# EAGLE design ltc3886_breakout_circuit (EAGLE 9.3.0)
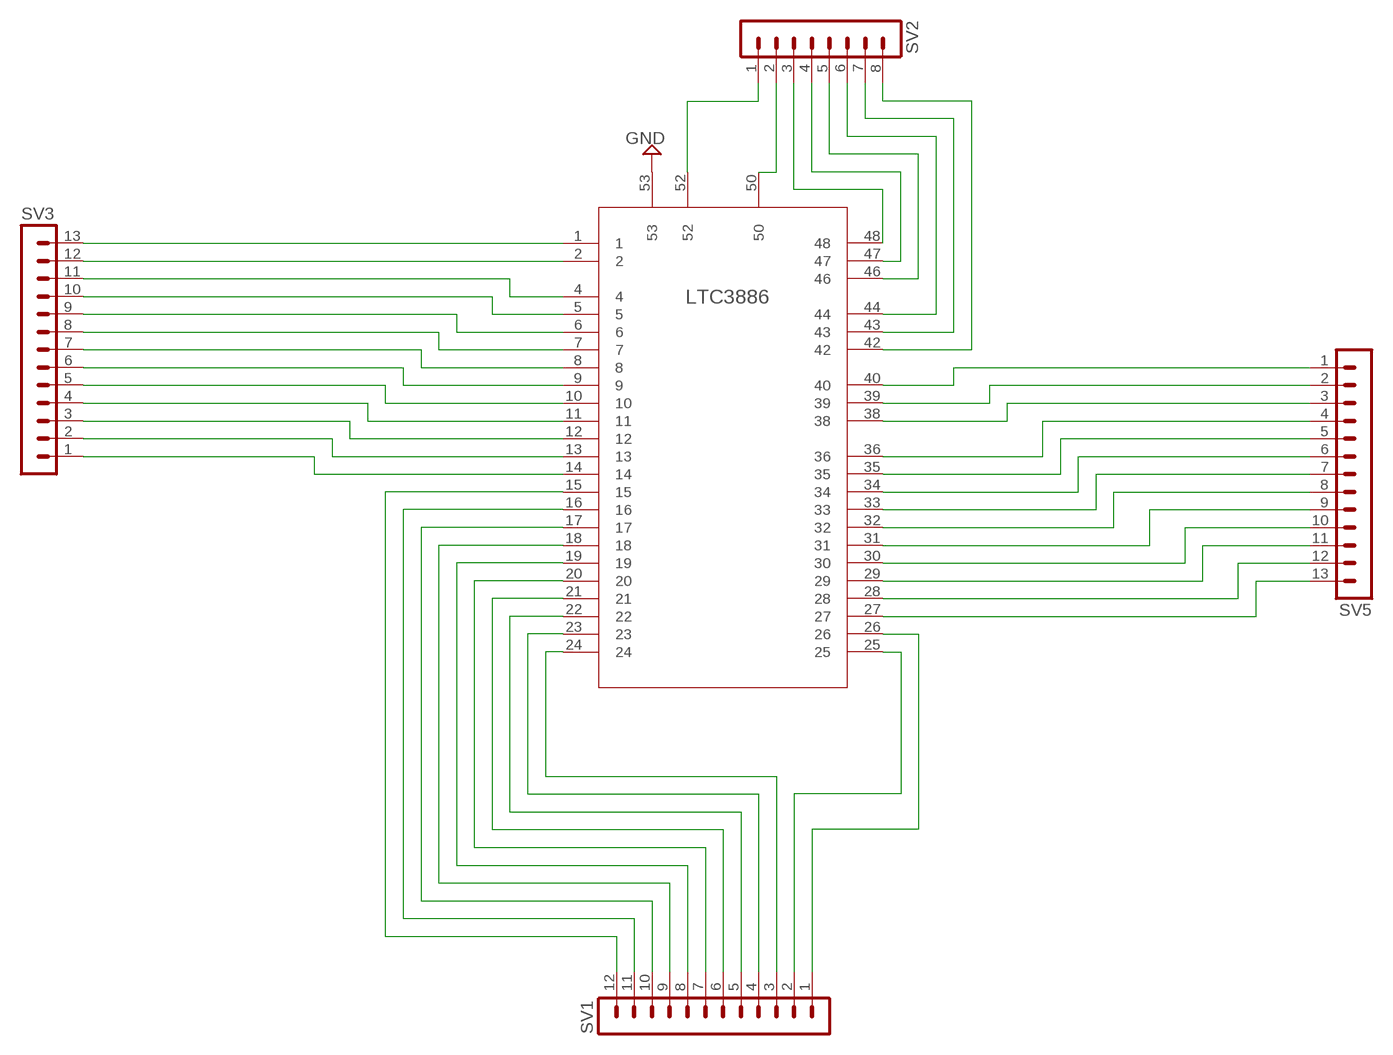
[diagram p0: schematic, sheet 1]

## Parts
SV1  MA12-1  [MA12-1]
SV2  MA08-1  [MA08-1]
SV3  MA13-1  [MA13-1]
SV5  MA13-1  [MA13-1]
U$1  LTC3886  [QFN-52_UKG_2]

## Nets
GND: U$1.53
N$1: SV3.13 U$1.1
N$2: SV3.12 U$1.2
N$3: SV3.11 U$1.4
N$4: SV3.10 U$1.5
N$5: SV3.9 U$1.6
N$6: SV3.8 U$1.7
N$7: SV3.7 U$1.8
N$8: SV3.6 U$1.9
N$9: SV3.5 U$1.10
N$10: SV3.4 U$1.11
N$11: SV3.3 U$1.12
N$12: SV3.2 U$1.13
N$13: SV3.1 U$1.14
N$14: SV1.12 U$1.15
N$15: SV1.11 U$1.16
N$16: SV1.10 U$1.17
N$17: SV1.9 U$1.18
N$18: SV1.8 U$1.19
N$19: SV1.7 U$1.20
N$20: SV1.6 U$1.21
N$21: SV2.3 U$1.48
N$22: SV2.4 U$1.47
N$23: SV2.5 U$1.46
N$24: SV2.6 U$1.44
N$25: SV2.7 U$1.43
N$26: SV2.8 U$1.42
N$27: SV5.1 U$1.40
N$28: SV5.2 U$1.39
N$29: SV5.3 U$1.38
N$30: SV5.4 U$1.36
N$31: SV5.5 U$1.35
N$32: SV5.6 U$1.34
N$33: SV5.7 U$1.33
N$34: SV5.8 U$1.32
N$35: SV5.9 U$1.31
N$36: SV5.10 U$1.30
N$37: SV5.11 U$1.29
N$38: SV5.12 U$1.28
N$39: SV5.13 U$1.27
N$40: SV1.1 U$1.26
N$41: SV1.5 U$1.22
N$42: SV1.4 U$1.23
N$43: SV1.3 U$1.24
N$44: SV1.2 U$1.25
N$45: SV2.1 U$1.52
N$46: SV2.2 U$1.50

## Library data of the parts
SV1 = con-lstb:MA12-1: PIN HEADER; OC_FARNELL: unknown; OC_NEWARK: unknown
SV2 = con-lstb:MA08-1: PIN HEADER; OC_FARNELL: unknown; OC_NEWARK: unknown
SV3 SV5 = con-lstb:MA13-1: PIN HEADER; OC_FARNELL: unknown; OC_NEWARK: unknown
U$1 = ltc3886:LTC3886

## Board
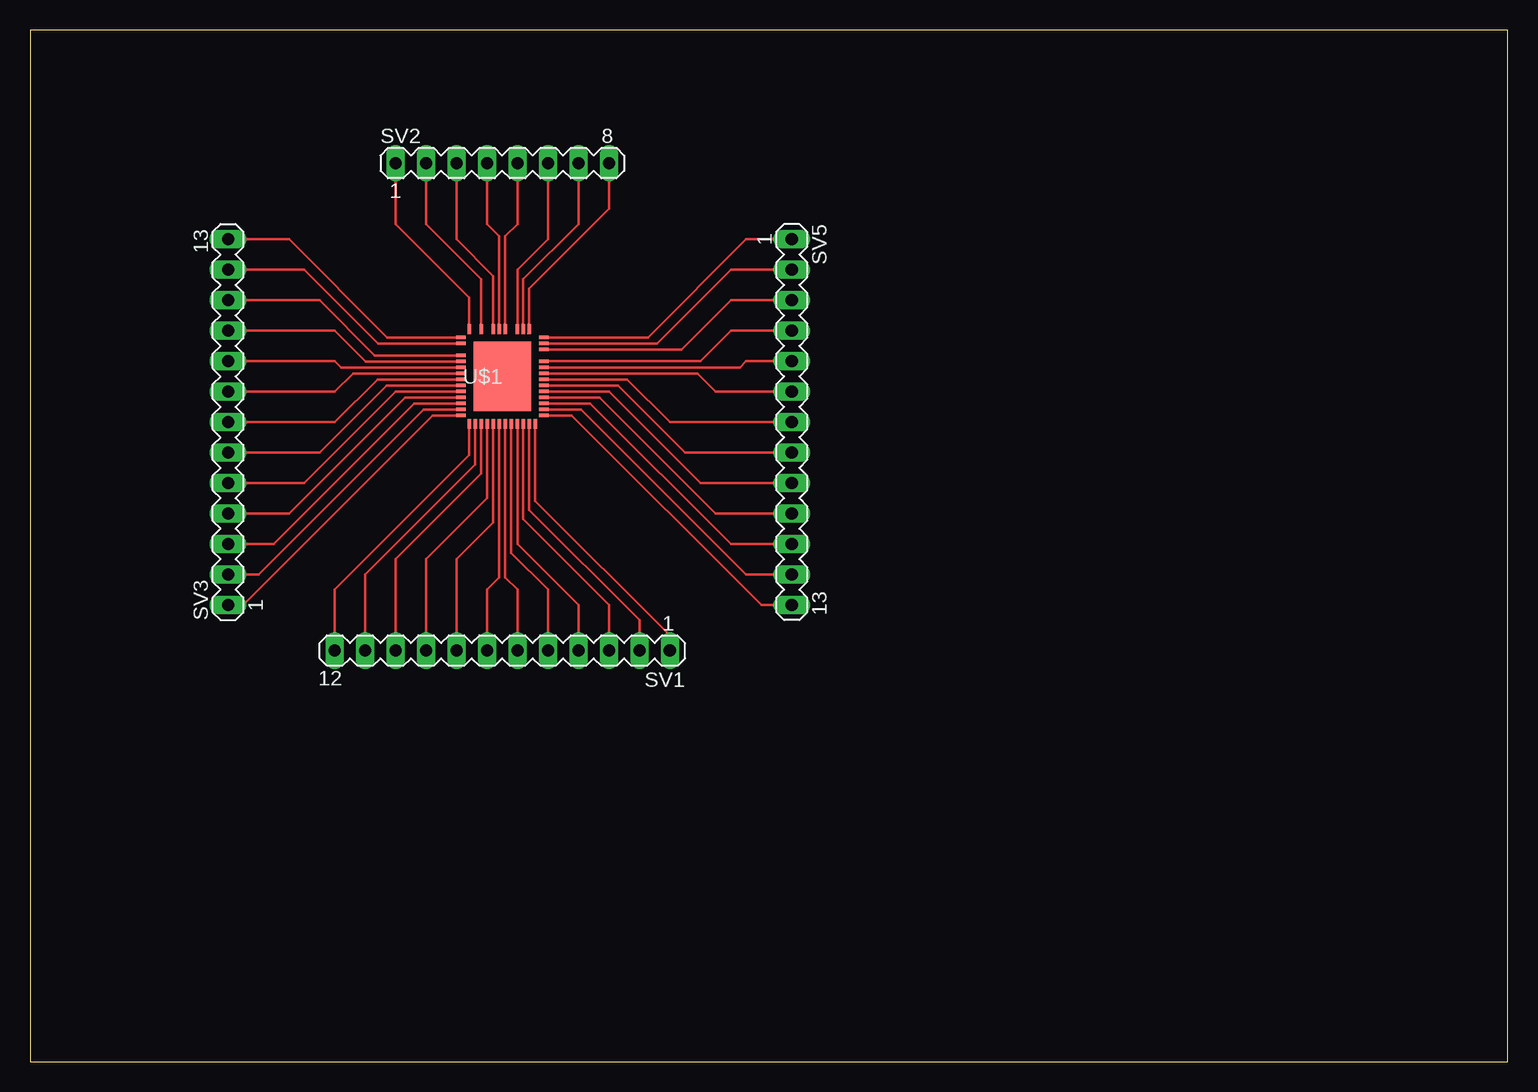
[diagram p1: board, top side]

Size 123.17 x 86.03 mm. Coordinates in mm from the lower left corner, seen from the top.
Outline: 0,0 123.17,0 123.17,86.03 0,86.03 0,0
Copper layers (1*16): Top 0.035mm / dielectric 1.5mm / Bottom 0.035mm
Design rules "default": minimum track width 6mil, minimum drill 0.35mm, track to track 6mil, track to pad 6mil, pad to pad 6mil, via to via 6mil, smd to smd 6mil, copper to edge 40mil, drill to drill 6mil, minimum pad ring 10mil, minimum via ring 8mil, stop-mask expansion 4mil, vias tented up to drill 0mil, thermal gap 10mil

### Footprints (pad centres in the part's own frame; a part is rotated, then mirrored left to right if it is on the bottom)
MA12-1 = drill 1.016 long: 1 -13.97,0; 2 -11.43,0; 3 -8.89,0; 4 -6.35,0; 5 -3.81,0; 6 -1.27,0; 7 1.27,0; 8 3.81,0; 9 6.35,0; 10 8.89,0; 11 11.43,0; 12 13.97,0
MA08-1 = drill 1.016 long: 1 -8.89,0; 2 -6.35,0; 3 -3.81,0; 4 -1.27,0; 5 1.27,0; 6 3.81,0; 7 6.35,0; 8 8.89,0
MA13-1 = drill 1.016 long: 1 -15.24,0; 2 -12.7,0; 3 -10.16,0; 4 -7.62,0; 5 -5.08,0; 6 -2.54,0; 7 0,0; 8 2.54,0; 9 5.08,0; 10 7.62,0; 11 10.16,0; 12 12.7,0; 13 15.24,0
QFN-52_UKG_2 = smd 0.813 x 0.305: 1 -3.454,3.25; 2 -3.454,2.75; 4 -3.454,1.75; 5 -3.454,1.25; 6 -3.454,0.75; 7 -3.454,0.25; 8 -3.454,-0.25; 9 -3.454,-0.75; 10 -3.454,-1.25; 11 -3.454,-1.75; 12 -3.454,-2.25; 13 -3.454,-2.75; 14 -3.454,-3.25; 27 3.454,-3.25; 28 3.454,-2.75; 29 3.454,-2.25; 30 3.454,-1.75; 31 3.454,-1.25; 32 3.454,-0.75; 33 3.454,-0.25; 34 3.454,0.25; 35 3.454,0.75; 36 3.454,1.25; 38 3.454,2.25; 39 3.454,2.75; 40 3.454,3.25 | smd 0.305 x 0.813: 15 -2.75,-3.95; 16 -2.25,-3.95; 17 -1.75,-3.95; 18 -1.25,-3.95; 19 -0.75,-3.95; 20 -0.25,-3.95; 21 0.25,-3.95; 22 0.75,-3.95; 23 1.25,-3.95; 24 1.75,-3.95; 25 2.25,-3.95; 26 2.75,-3.95; 42 2.25,3.95; 43 1.75,3.95; 44 1.25,3.95; 46 0.25,3.95; 47 -0.25,3.95; 48 -0.75,3.95; 50 -1.75,3.95; 52 -2.75,3.95 | smd 4.801 x 5.791: 53 0,0

### Placement (x,y rotation side)
SV1  39.37,34.29 180 top
SV2  39.37,74.93 0 top
SV3  16.51,53.34 90 top
SV5  63.5,53.34 270 top
U$1  39.37,57.15 0 top

### Tracks (layer width: path | path; a pad name or v marks a point on that pad's centre or on a via)
N$1
  Top 0.203: U$1.1 29.77,60.4 21.59,68.58 SV3.13
N$2
  Top 0.203: U$1.2 29,59.9 22.86,66.04 SV3.12
N$3
  Top 0.203: U$1.4 28.73,58.9 24.13,63.5 SV3.11
N$4
  Top 0.203: U$1.5 27.96,58.4 25.4,60.96 SV3.10
N$5
  Top 0.203: U$1.6 25.92,57.9 25.4,58.42 SV3.9
N$6
  Top 0.203: U$1.7 26.92,57.4 25.4,55.88 SV3.8
N$7
  Top 0.203: U$1.8 28.96,56.9 25.4,53.34 SV3.7
N$8
  Top 0.203: U$1.9 29.73,56.4 24.13,50.8 SV3.6
N$9
  Top 0.203: U$1.10 35.9,55.88 30.48,55.88 22.86,48.26 SV3.5
N$10
  Top 0.203: U$1.11 31.27,55.4 21.59,45.72 SV3.4
N$11
  Top 0.203: U$1.12 32.04,54.9 20.32,43.18 SV3.3
N$12
  Top 0.203: U$1.13 32.81,54.4 19.05,40.64 SV3.2
N$13
  Top 0.203: U$1.14 33.58,53.9 17.78,38.1 SV3.1
N$14
  Top 0.203: U$1.15 36.62,50.59 25.4,39.37 SV1.12
N$15
  Top 0.203: U$1.16 37.12,49.82 27.94,40.64 SV1.11
N$16
  Top 0.203: U$1.17 37.62,49.05 30.48,41.91 SV1.10
N$17
  Top 0.203: U$1.18 38.1,53.18 38.1,46.99 33.02,41.91 SV1.9
N$18
  Top 0.203: U$1.19 38.62,44.97 35.56,41.91 SV1.8
N$19
  Top 0.203: U$1.20 39.12,40.39 38.1,39.37 SV1.7
N$20
  Top 0.203: U$1.21 39.62,40.39 40.64,39.37 SV1.6
N$21
  Top 0.203: U$1.48 38.62,65.52 35.56,68.58 SV2.3
N$22
  Top 0.203: U$1.47 39.12,68.83 38.1,69.85 SV2.4
N$23
  Top 0.203: U$1.46 39.62,68.83 40.64,69.85 SV2.5
N$24
  Top 0.203: U$1.44 40.64,61.12 40.64,66.04 43.18,68.58 SV2.6
N$25
  Top 0.203: U$1.43 41.12,65.25 45.72,69.85 SV2.7
N$26
  Top 0.203: U$1.42 41.62,64.48 48.26,71.12 SV2.8
N$27
  Top 0.203: U$1.40 51.51,60.4 59.69,68.58 SV5.1
N$28
  Top 0.203: U$1.39 52.28,59.9 58.42,66.04 SV5.2
N$29
  Top 0.203: U$1.38 54.32,59.4 58.42,63.5 SV5.3
N$30
  Top 0.203: U$1.36 42.84,58.42 55.88,58.42 58.42,60.96 SV5.4
N$31
  Top 0.203: U$1.35 59.17,57.9 59.69,58.42 SV5.5
N$32
  Top 0.203: U$1.34 55.63,57.4 57.15,55.88 SV5.6
N$33
  Top 0.203: U$1.33 49.78,56.9 53.34,53.34 SV5.7
N$34
  Top 0.203: U$1.32 49.01,56.4 54.61,50.8 SV5.8
N$35
  Top 0.203: U$1.31 42.84,55.88 48.26,55.88 55.88,48.26 SV5.9
N$36
  Top 0.203: U$1.30 47.47,55.4 57.15,45.72 SV5.10
N$37
  Top 0.203: U$1.29 46.7,54.9 58.42,43.18 SV5.11
N$38
  Top 0.203: U$1.28 45.93,54.4 59.69,40.64 SV5.12
N$39
  Top 0.203: U$1.27 45.16,53.9 60.96,38.1 SV5.13
N$40
  Top 0.203: U$1.26 42.12,46.78 53.34,35.56 SV1.1
N$41
  Top 0.203: U$1.22 40.12,42.43 43.18,39.37 SV1.5
N$42
  Top 0.203: U$1.23 40.64,53.18 40.64,43.18 45.72,38.1 SV1.4
N$43
  Top 0.203: U$1.24 41.12,45.24 48.26,38.1 SV1.3
N$44
  Top 0.203: U$1.25 41.62,46.01 50.8,36.83 SV1.2
N$45
  Top 0.203: U$1.52 36.62,63.71 30.48,69.85 SV2.1
N$46
  Top 0.203: U$1.50 37.62,65.25 33.02,69.85 SV2.2